# EAGLE design CardSide (EAGLE 6.5.0)
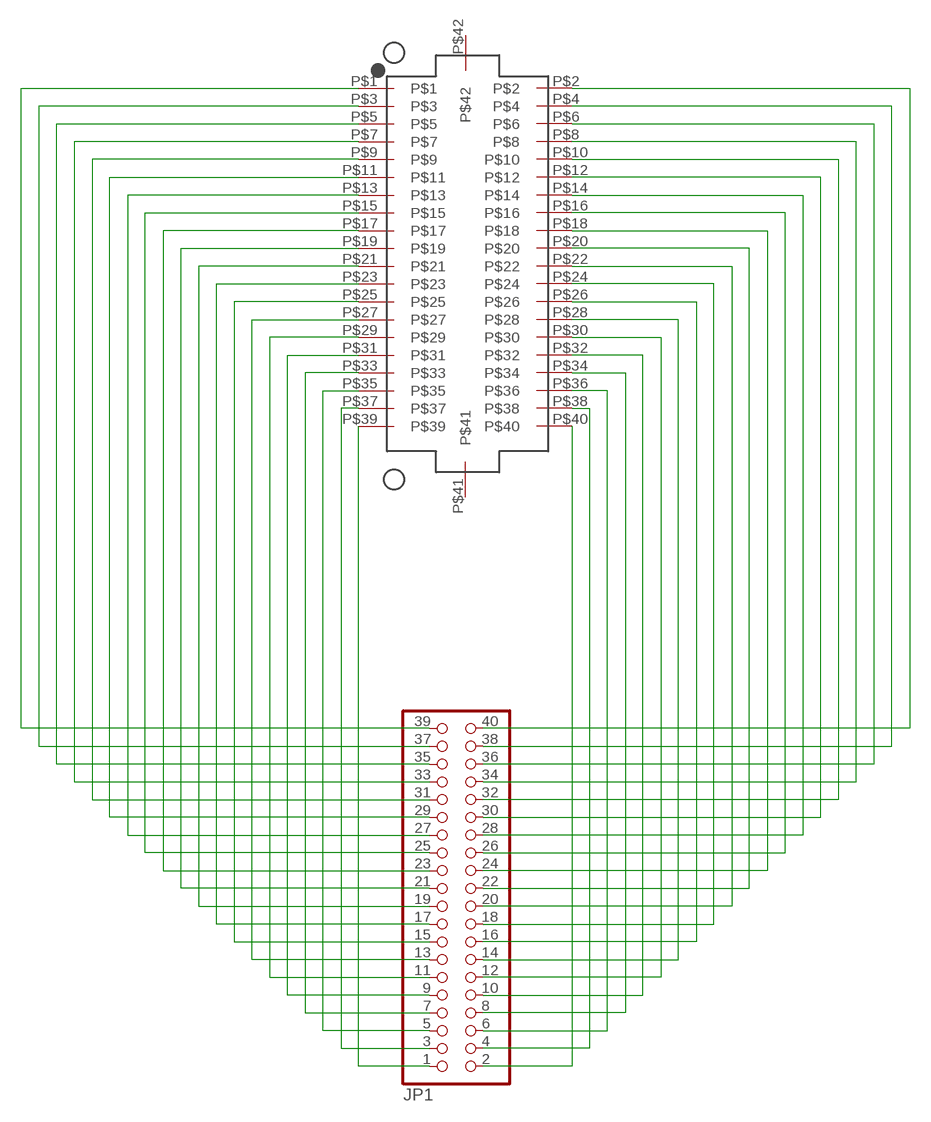
[diagram p0: schematic, sheet 1]

## Parts
JP1  PINHD-2X20  [2X20]
U$2  DF12_M  [DF12_M]

## Nets
N$1: JP1.39 U$2.P$1
N$2: JP1.37 U$2.P$3
N$3: JP1.35 U$2.P$5
N$4: JP1.33 U$2.P$7
N$5: JP1.31 U$2.P$9
N$6: JP1.29 U$2.P$11
N$7: JP1.27 U$2.P$13
N$8: JP1.25 U$2.P$15
N$9: JP1.23 U$2.P$17
N$10: JP1.21 U$2.P$19
N$11: JP1.19 U$2.P$21
N$12: JP1.17 U$2.P$23
N$13: JP1.15 U$2.P$25
N$14: JP1.13 U$2.P$27
N$15: JP1.11 U$2.P$29
N$16: JP1.9 U$2.P$31
N$17: JP1.7 U$2.P$33
N$18: JP1.5 U$2.P$35
N$19: JP1.3 U$2.P$37
N$20: JP1.1 U$2.P$39
N$21: JP1.2 U$2.P$40
N$22: JP1.4 U$2.P$38
N$23: JP1.6 U$2.P$36
N$24: JP1.8 U$2.P$34
N$25: JP1.10 U$2.P$32
N$26: JP1.12 U$2.P$30
N$27: JP1.14 U$2.P$28
N$28: JP1.16 U$2.P$26
N$29: JP1.18 U$2.P$24
N$30: JP1.20 U$2.P$22
N$31: JP1.22 U$2.P$20
N$32: JP1.24 U$2.P$18
N$33: JP1.26 U$2.P$16
N$34: JP1.28 U$2.P$14
N$35: JP1.30 U$2.P$12
N$36: JP1.32 U$2.P$10
N$37: JP1.34 U$2.P$8
N$38: JP1.36 U$2.P$6
N$39: JP1.38 U$2.P$4
N$40: JP1.40 U$2.P$2
Unconnected: U$2.P$41 U$2.P$42

## Library data of the parts
JP1 = pinhead:PINHD-2X20: PIN HEADER
U$2 = KW2:DF12_M: Hirose DF12 Male Connector

## Board
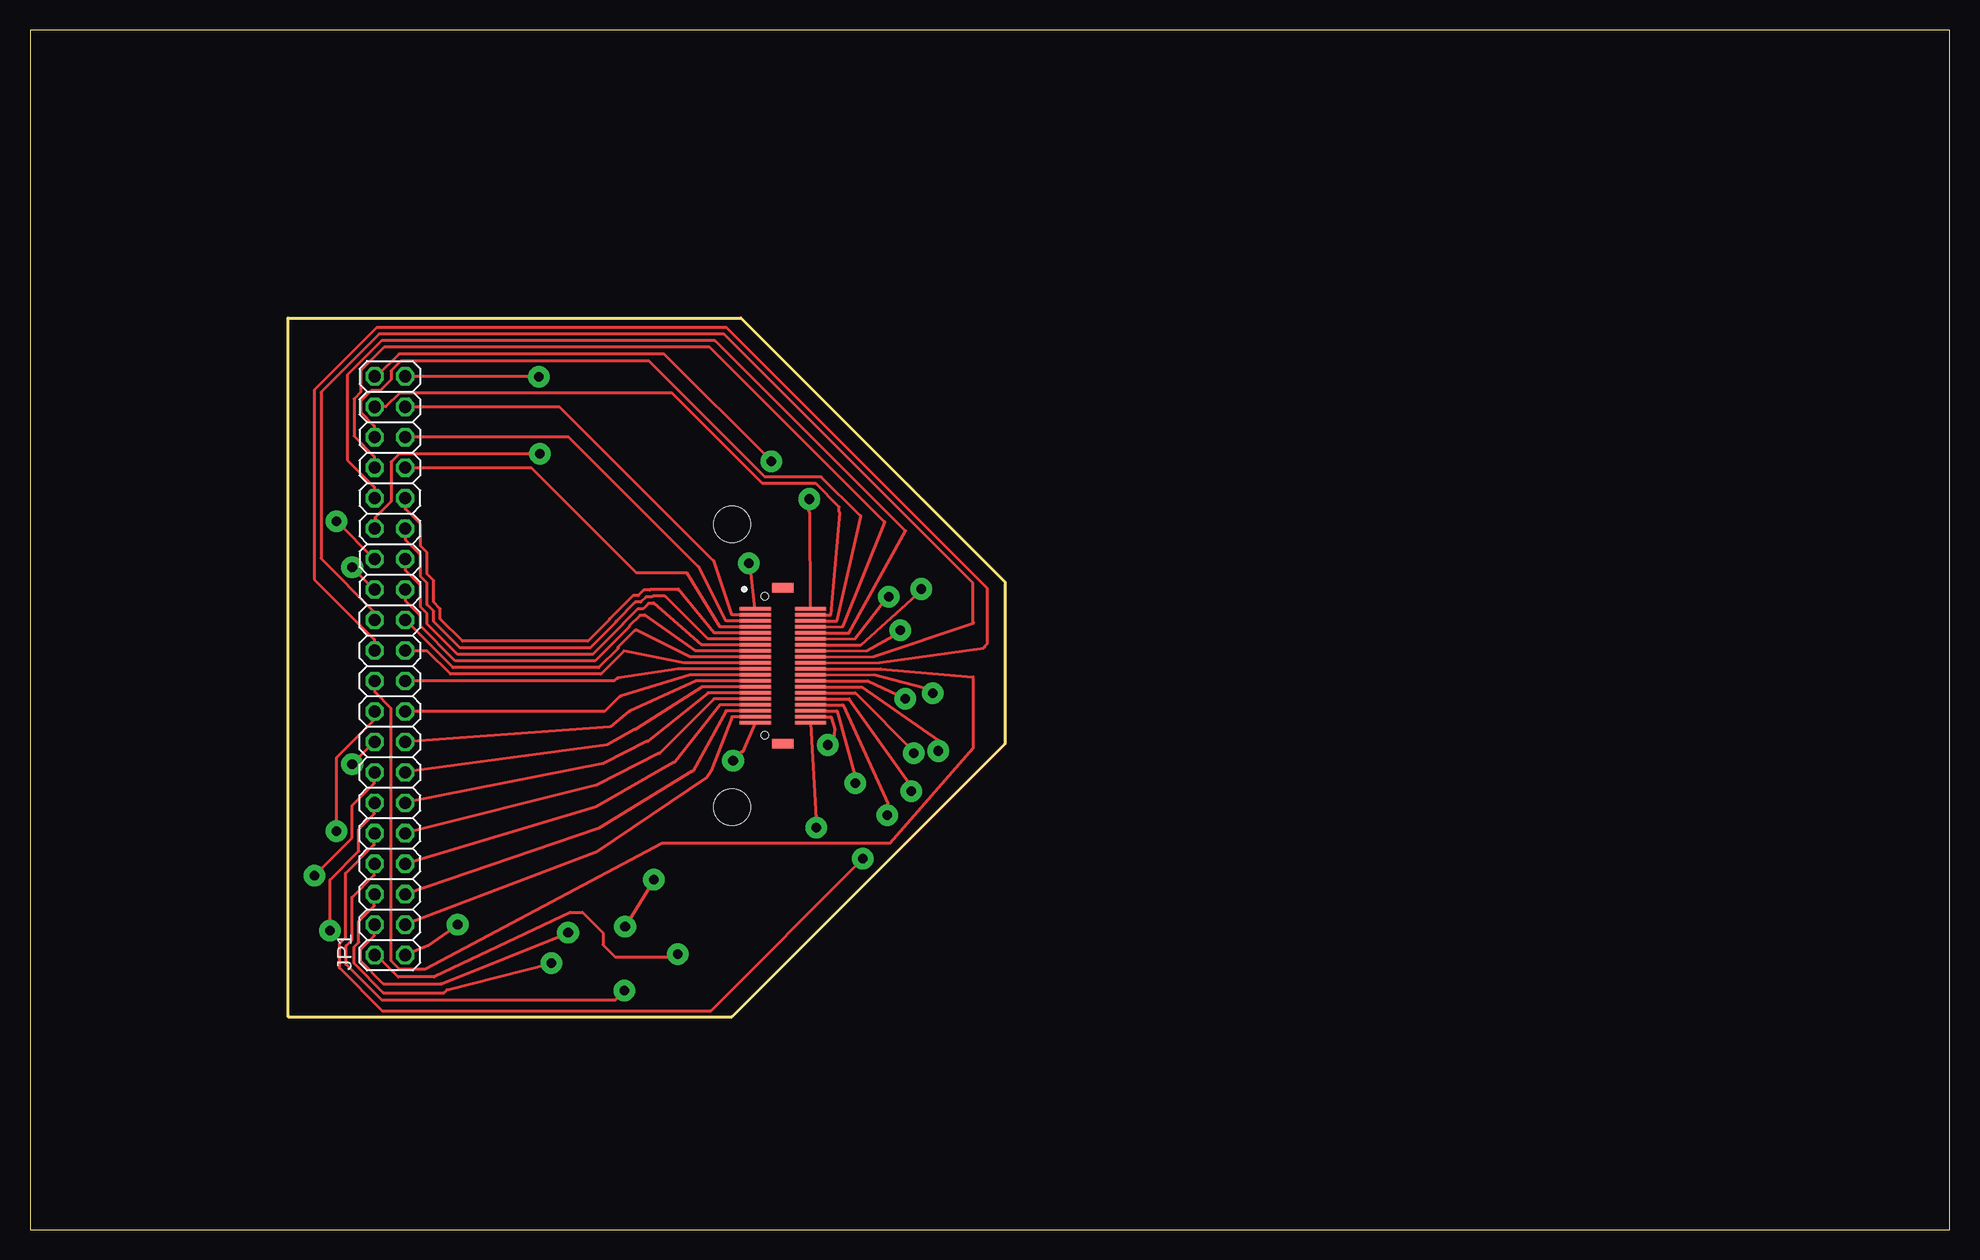
[diagram p1: board, top side]
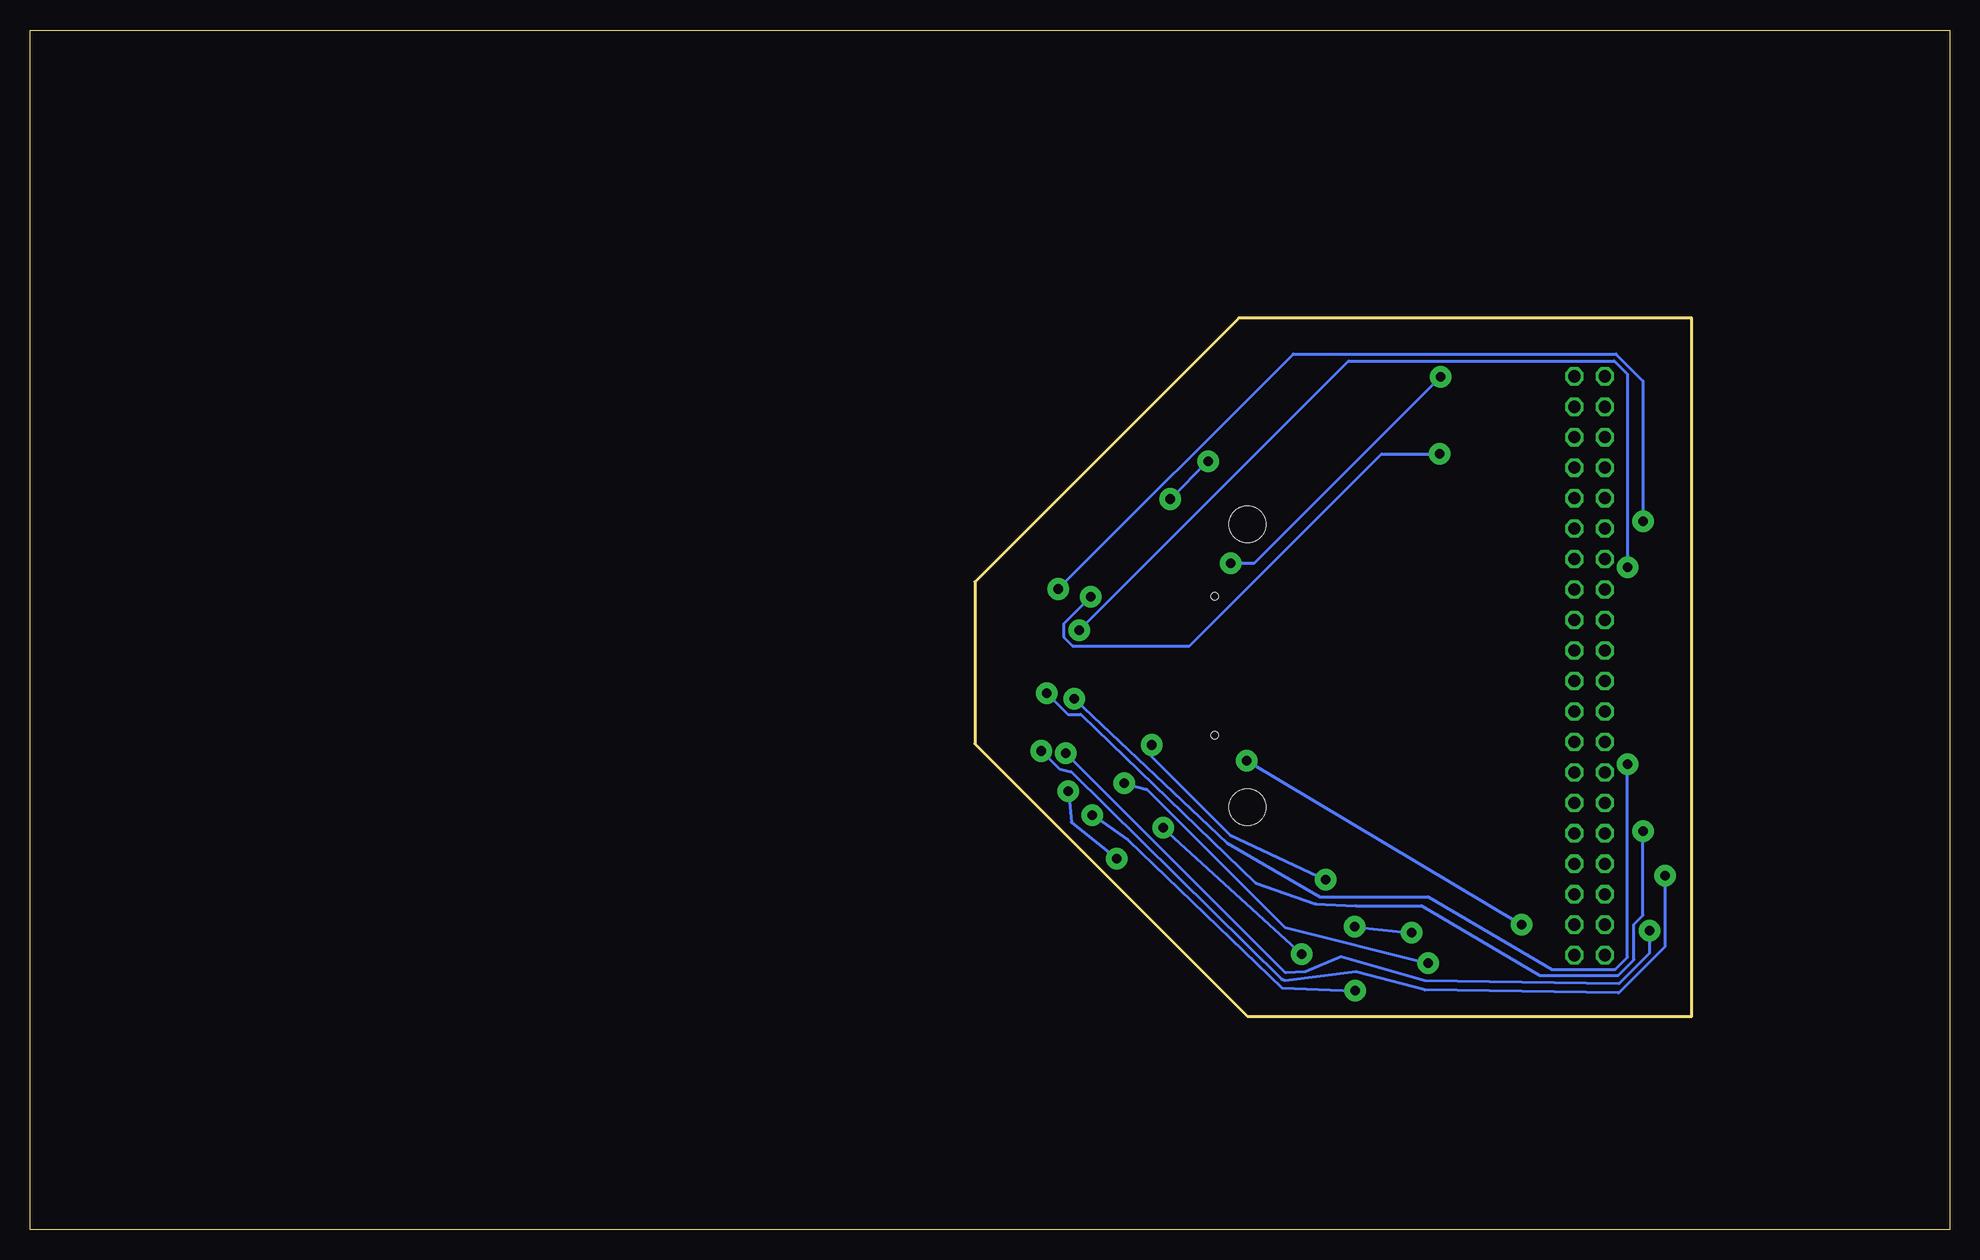
[diagram p2: board, bottom side, seen from below]

Size 160 x 100 mm. Coordinates in mm from the lower left corner, seen from the top.
Outline: 0,0 160,0 160,100 0,100 0,0
Copper layers (1*16): Top 0.035mm / dielectric 1.5mm / Bottom 0.035mm
Design rules "default *": minimum track width 10mil, minimum drill 0.8mm, track to track 0.25mm, track to pad 0.25mm, pad to pad 0.25mm, via to via 0.25mm, smd to smd 0.25mm, copper to edge 40mil, drill to drill 8mil, minimum pad ring 10mil, minimum via ring 0.5mm, stop-mask expansion 4mil, vias tented up to drill 0mil, thermal gap 10mil
bRestrict: area 27.8,22 to 32.2,72
Milling: 6 lines

### Footprints (pad centres in the part's own frame; a part is rotated, then mirrored left to right if it is on the bottom)
2X20 = drill 1.016 octagon: 1 -24.13,-1.27; 2 -24.13,1.27; 3 -21.59,-1.27; 4 -21.59,1.27; 5 -19.05,-1.27; 6 -19.05,1.27; 7 -16.51,-1.27; 8 -16.51,1.27; 9 -13.97,-1.27; 10 -13.97,1.27; 11 -11.43,-1.27; 12 -11.43,1.27; 13 -8.89,-1.27; 14 -8.89,1.27; 15 -6.35,-1.27; 16 -6.35,1.27; 17 -3.81,-1.27; 18 -3.81,1.27; 19 -1.27,-1.27; 20 -1.27,1.27; 21 1.27,-1.27; 22 1.27,1.27; 23 3.81,-1.27; 24 3.81,1.27; 25 6.35,-1.27; 26 6.35,1.27; 27 8.89,-1.27; 28 8.89,1.27; 29 11.43,-1.27; 30 11.43,1.27; 31 13.97,-1.27; 32 13.97,1.27; 33 16.51,-1.27; 34 16.51,1.27; 35 19.05,-1.27; 36 19.05,1.27; 37 21.59,-1.27; 38 21.59,1.27; 39 24.13,-1.27; 40 24.13,1.27
DF12_M = smd 0.3 x 2.6: P$1 4.75,2.3; P$2 4.75,-2.3; P$3 4.25,2.3; P$4 4.25,-2.3; P$5 3.75,2.3; P$6 3.75,-2.3; P$7 3.25,2.3; P$8 3.25,-2.3; P$9 2.75,2.3; P$10 2.75,-2.3; P$11 2.25,2.3; P$12 2.25,-2.3; P$13 1.75,2.3; P$14 1.75,-2.3; P$15 1.25,2.3; P$16 1.25,-2.3; P$17 0.75,2.3; P$18 0.75,-2.3; P$19 0.25,2.3; P$20 0.25,-2.3; P$21 -0.25,2.3; P$22 -0.25,-2.3; P$23 -0.75,2.3; P$24 -0.75,-2.3; P$25 -1.25,2.3; P$26 -1.25,-2.3; P$27 -1.75,2.3; P$28 -1.75,-2.3; P$29 -2.25,2.3; P$30 -2.25,-2.3; P$31 -2.75,2.3; P$32 -2.75,-2.3; P$33 -3.25,2.3; P$34 -3.25,-2.3; P$35 -3.75,2.3; P$36 -3.75,-2.3; P$37 -4.25,2.3; P$38 -4.25,-2.3; P$39 -4.75,2.3; P$40 -4.75,-2.3 | smd 0.8 x 1.8: P$41 -6.5,0; P$42 6.5,0 | hole 0.6: -5.8,1.5; 5.8,1.5 | hole 3.048: 11.8,4.24; -11.8,4.24

### Placement (x,y rotation side)
JP1  30,47 90 top
U$2  62.75,47 90 top

### Tracks (layer width: path | path; a pad name or v marks a point on that pad's centre or on a via)
N$1  (via drill 0.8)
  Top 0.254: U$2.P$1 60,55.5 v59.9,55.55 | v42.4,71.1 31.3,71.1 JP1.39
  Bottom 0.254: v42.4,71.1 57.95,55.55 v59.9,55.55
N$2
  Top 0.254: U$2.P$3 58.5,51.25 57,55.75 56.9,55.8 44.15,68.55 31.3,68.55 JP1.37
N$3
  Top 0.254: U$2.P$5 58,50.75 55.75,55.25 55.65,55.3 44.9,66.05 JP1.35
N$4
  Top 0.254: U$2.P$7 57.5,50.25 54.75,54.75 50.55,54.75 41.8,63.5 31.3,63.5 JP1.33
N$5
  Top 0.254: U$2.P$9 57,49.75 54.02,53.41 53.95,53.35 51.7,53.35 51.65,53.3 51.15,53.3 50.7,52.85 50.25,52.85 48.3,50.9 48.3,50.85 46.5,49.05 36.05,49.05 34.2,50.9 34.2,51.75 33.65,52.3 33.65,54.1 33.1,54.65 33.1,56.45 32.55,57 32.55,58.8 31.3,60.05 31.3,60.95 JP1.31
N$6
  Top 0.254: U$2.P$11 56.5,49.25 53,52.75 52.9,52.8 51.9,52.8 51.85,52.75 51.35,52.75 50.9,52.3 50.45,52.3 48.85,50.7 48.85,50.65 46.7,48.5 35.85,48.5 33.65,50.7 33.65,51.55 33.1,52.1 33.1,53.9 32.55,54.45 32.55,56.25 31.3,57.5 31.3,58.4 JP1.29
N$7
  Top 0.254: U$2.P$13 56,48.75 52,52.25 51.9,52.2 51.55,52.2 51.1,51.75 50.65,51.75 49.4,50.5 49.4,50.45 46.9,47.95 35.65,47.95 33.1,50.5 33.1,51.35 32.55,51.9 32.55,53.7 31.3,54.95 31.3,55.85 JP1.27
N$8
  Top 0.254: U$2.P$15 55.5,48.25 51.25,51.25 51.15,51.2 50.85,51.2 49.95,50.3 49.95,50.25 47.1,47.4 35.45,47.4 32.55,50.3 32.55,51.15 31.3,52.4 31.3,53.35 JP1.25
N$9
  Top 0.254: U$2.P$17 55,47.75 50.5,50 50.4,49.95 49,48.55 49,48.45 47.4,46.85 35.25,46.85 31.3,50.8 JP1.23
N$10
  Top 0.254: U$2.P$19 54.5,47.25 49.5,48.25 49.45,48.15 47.6,46.3 35.05,46.3 33.1,48.25 31.3,48.25 JP1.21
N$11
  Top 0.254: U$2.P$21 54,46.75 49,46 48.9,45.95 48.7,45.75 31.3,45.75 JP1.19
N$12
  Top 0.254: U$2.P$23 55,46.25 49.25,44.5 49.15,44.45 47.9,43.2 31.3,43.2 JP1.17
N$13
  Top 0.254: U$2.P$25 55.5,45.75 50,43.25 49.9,43.2 48.35,41.9 JP1.15
N$14
  Top 0.254: U$2.P$27 56,45.25 50.5,41.75 50.4,41.7 48.1,40.4 31.3,38.15 JP1.13
N$15
  Top 0.254: U$2.P$29 56.5,44.75 51.5,40.75 51.4,40.7 47.8,38.85 31.3,35.6 JP1.11
N$16
  Top 0.254: U$2.P$31 57,44.25 52.5,39.75 52.4,39.7 47.25,37.05 31.3,33.05 JP1.9
N$17
  Top 0.254: U$2.P$33 57.5,43.75 53.75,39 53.65,38.95 47.2,35.25 31.3,30.5 JP1.7
N$18
  Top 0.254: U$2.P$35 58,43.25 55.25,38.25 55.15,38.2 47.4,33.45 JP1.5
N$19
  Top 0.254: U$2.P$37 58.5,42.75 56.75,38.25 56.4,37.7 47.15,31.45 31.3,25.45 JP1.3
N$20  (via drill 0.8)
  Top 0.254: U$2.P$39 59.4,39.83 59.3,39.85 v58.6,39.1 | v35.65,25.4 33.15,23.65 31.3,22.9 JP1.1
  Bottom 0.254: v58.6,39.1 v35.65,25.4
N$21  (via drill 0.8)
  Top 0.254: U$2.P$40 65.5,34.25 65.55,34.15 v65.55,33.5 | JP1.2 28.75,22.85 28.9,22.85 30.7,21.05 33.7,21.05 45.05,26.45 46.05,26.45 47.75,24.75 47.75,23.75 48.75,22.75 53.8,22.75 v54,22.95
  Bottom 0.254: v65.55,33.5 v54,22.95
N$22  (via drill 0.8)
  Top 0.254: U$2.P$38 66.75,42.75 67.1,41.66 67,40.9 v66.5,40.4 | v52,29.15 v49.6,25.25 | JP1.4 28.7,25.4 28.7,24.5 27.55,23.35 27.55,22.4 29.45,20.5 34.25,20.5 v44.85,24.75
  Bottom 0.254: v49.6,25.25 v44.85,24.75 | v52,29.15 60,32.9 66.5,39.4 v66.5,40.4
N$23  (via drill 0.8)
  Top 0.254: U$2.P$36 67.26,43.25 68.86,37.48 69,37.45 v68.8,37.2 | JP1.6 28.7,27.95 28.7,27 27.4,25.7 27.4,23.95 27,23.55 27,22.2 29.45,19.75 34.5,19.75 34.75,20 v43.45,22.2
  Bottom 0.254: v43.45,22.2 55.4,25.2 66.9,36.7 v68.8,37.2
N$24  (via drill 0.8)
  Top 0.254: U$2.P$34 67.77,43.75 71.5,35.5 71.45,35.4 v71.45,34.55 | JP1.8 28.7,30.45 28.7,29.55 26.85,27.7 26.85,24.15 26.35,23.65 26.35,22.1 29.3,19.15 48.8,19.15 v49.55,19.9
  Bottom 0.254: v71.45,34.55 68.5,32.5 55.65,20.15 v49.55,19.9
N$25  (via drill 0.8)
  Top 0.254: U$2.P$32 68.28,44.25 73.25,37.25 73.2,37.15 v73.45,36.55 | JP1.10 28.7,33 28.7,32.1 26.3,29.7 26.3,24.35 25.8,23.85 25.8,21.8 29.35,18.25 56.75,18.25 v69.4,30.9
  Bottom 0.254: v69.4,30.9 73.2,33.95 v73.45,36.55
N$26  (via drill 0.8)
  Top 0.254: U$2.P$30 68.8,44.75 73.73,39.78 v73.65,39.7 | v25,24.9 25,29.15 27.4,31.55 27.4,33.35 28.7,34.65 28.7,35.55 JP1.12
  Bottom 0.254: v25,24.9 25,23.05 27.55,20.5 43.75,20.75 50.75,22.75 53.7,21.5 55.35,21.4 v73.65,39.7
N$27  (via drill 0.8)
  Top 0.254: U$2.P$28 69.31,45.21 75.75,40.75 75.7,40.65 v75.7,39.9 | v23.7,29.5 26.85,32.65 26.85,35.35 28.7,37.2 28.7,38.1 JP1.14
  Bottom 0.254: v23.7,29.5 23.7,23.6 27.57,19.73 43.75,19.98 49.5,21.5 55.4,20.75 55.65,20.85 73.2,38.15 74.2,38.4 v75.7,39.9
N$28  (via drill 0.8)
  Top 0.254: U$2.P$26 69.85,45.74 72.96,44.27 v72.95,44.25 | v26.85,38.8 28.7,40.65 JP1.16
  Bottom 0.254: v26.85,38.8 26.85,22.7 27.85,21.7 33.15,21.7 43.45,27.75 52.5,27.75 60.25,32.25 v72.95,44.25
N$29  (via drill 0.8)
  Top 0.254: U$2.P$24 70.36,46.26 75.28,44.97 75.25,44.85 v75.25,44.7 | v25.55,33.2 25.55,39.35 28.7,42.5 28.7,43.15 JP1.18
  Bottom 0.254: v25.55,33.2 25.55,26.2 26.3,25.45 26.3,22.5 27.65,21.15 34.15,21.15 34.25,21.25 44,27 49.5,27 52.85,27.15 57.85,28.9 72.4,42.95 73.5,42.95 v75.25,44.7
N$30
  Top 0.254: U$2.P$22 70.91,46.74 78.61,46.08 78.6,45.95 78.6,40.1 71.7,32.2 52.7,32.2 32.95,21.7 30.8,21.7 30.1,22.4 30.1,43.45 28.75,44.8 28.75,45.7 JP1.20
N$31
  Top 0.254: U$2.P$20 70.82,47.26 79.5,48.5 79.55,48.6 79.8,48.85 79.8,53.45 58.05,75.2 28.9,75.2 23.7,70 23.7,54.2 28.7,49.2 28.7,48.3 JP1.22
N$32
  Top 0.254: U$2.P$18 70.3,47.75 78.64,50.54 78.6,50.65 78.6,53.9 57.85,74.65 29.1,74.65 24.25,69.8 24.25,55.95 28.7,51.5 28.7,50.85 JP1.24
N$33  (via drill 0.8)
  Top 0.254: U$2.P$16 69.79,48.25 72.59,49.87 v72.55,49.95 | v26.85,55.2 28.7,53.35 JP1.26
  Bottom 0.254: v26.85,55.2 26.85,71.3 27.95,72.4 50.1,72.4 v72.55,49.95
N$34  (via drill 0.8)
  Top 0.254: U$2.P$14 69.28,48.75 74.37,53.33 v74.3,53.4 | v25.55,59.05 28.7,55.9 JP1.28
  Bottom 0.254: v25.55,59.05 25.55,70.75 27.8,73 54.7,73 v74.3,53.4
N$35  (via drill 0.8)
  Top 0.254: U$2.P$12 68.78,49.25 71.52,52.81 v71.6,52.75 | v42.5,64.65 30.75,64.65 30.1,64 30.1,60.7 28.75,59.35 28.75,58.45 JP1.30
  Bottom 0.254: v42.5,64.65 47.35,64.65 63.35,48.65 73.1,48.65 73.85,49.4 73.85,50.5 v71.6,52.75
N$36
  Top 0.254: U$2.P$10 68.27,49.74 73,58.25 | 73,58.25 | JP1.32 28.7,61 28.7,61.9 26.45,64.15 26.45,71.25 29.3,74.1 57.1,74.1 72.9,58.3 73,58.25
N$37
  Top 0.254: U$2.P$8 67.76,50.25 71.25,59 71.15,59.05 56.65,73.55 29.5,73.55 27.55,71.6 27.55,69.8 27,69.25 27,66.15 28.7,64.45 28.7,63.55 JP1.34
N$38
  Top 0.254: U$2.P$6 67.26,50.75 69.25,59.5 69.15,59.55 65.95,62.75 61.25,62.75 51.6,72.4 30.9,72.4 30.1,71.6 30.1,70.85 29.2,69.95 28.45,69.95 27.55,69.05 27.55,68.15 28.7,67 28.7,66.05 JP1.36
N$39
  Top 0.254: U$2.P$4 66.75,51.25 67.5,59.75 67.45,59.85 67.45,60.25 65.5,62.2 61.05,62.2 53.5,69.75 30.8,69.75 29.65,68.6 28.75,68.6 JP1.38
N$40  (via drill 0.8)
  Top 0.254: U$2.P$2 65,59.75 64.95,59.85 v64.95,60.9 | v61.8,64.05 52.85,73 30.75,73 28.9,71.15 28.75,71.15 JP1.40
  Bottom 0.254: v64.95,60.9 v61.8,64.05